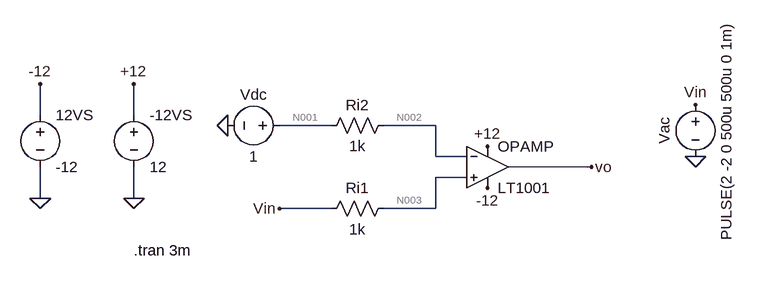
[diagram p0: schematic exp81.asc]
exp81.asc, the LTspice schematic file:
Version 4
SHEET 1 880 680
WIRE -464 64 -464 16
WIRE -320 64 -320 16
WIRE -16 80 -96 80
WIRE 144 80 64 80
WIRE 144 128 144 80
WIRE 192 128 144 128
WIRE 384 144 256 144
WIRE 192 160 144 160
WIRE -464 192 -464 144
WIRE -320 192 -320 144
WIRE -16 208 -96 208
WIRE 144 208 144 160
WIRE 144 208 64 208
FLAG -320 16 +12
FLAG -464 16 -12
FLAG -464 192 0
FLAG -320 192 0
FLAG 224 176 -12
FLAG 224 112 +12
FLAG 384 144 vo
FLAG -176 80 0
FLAG 544 128 0
FLAG 544 48 Vin
FLAG -96 208 Vin
SYMBOL voltage -320 48 R0
WINDOW 123 0 0 Left 0
WINDOW 39 0 0 Left 0
SYMATTR InstName -12VS
SYMATTR Value 12
SYMBOL voltage -464 48 R0
WINDOW 123 0 0 Left 0
WINDOW 39 0 0 Left 0
SYMATTR InstName 12VS
SYMATTR Value -12
SYMBOL OpAmps\\LT1001 224 80 R0
SYMATTR InstName OPAMP
SYMBOL res 80 64 R90
WINDOW 0 0 56 VBottom 2
WINDOW 3 32 56 VTop 2
SYMATTR InstName Ri2
SYMATTR Value 1k
SYMBOL res 80 192 R90
WINDOW 0 0 56 VBottom 2
WINDOW 3 32 56 VTop 2
SYMATTR InstName Ri1
SYMATTR Value 1k
SYMBOL voltage -80 80 R90
WINDOW 0 -32 56 VBottom 2
WINDOW 3 32 56 VTop 2
SYMATTR InstName Vdc
SYMATTR Value 1
SYMBOL voltage 544 32 R0
WINDOW 0 -32 56 VBottom 2
WINDOW 3 32 56 VTop 2
WINDOW 123 0 0 Left 0
WINDOW 39 0 0 Left 0
SYMATTR InstName Vac
SYMATTR Value PULSE(2 -2 0 500u 500u 0 1m)
TEXT -320 272 Left 2 !.tran 3m

The netlist it stands for:
* exp81.asc
V§-12VS +12 0 12
V§12VS -12 0 -12
XOPAMP N003 N002 +12 -12 vo LT1001  ; pins In+ In- V+ V- OUT
Ri2 N002 N001 1k
Ri1 N003 Vin 1k
Vdc N001 0 1
Vac Vin 0 PULSE(2 -2 0 500u 500u 0 1m)
.tran 3m
.lib LTC.lib
.backanno
.end

* Results of the author's LTspice run, read from the files saved beside the schematic
* Operating Point, zero values left out:
*   V(+12) = 12 V
*   V(-12) = -12 V
*   V(n002) = 1 V
*   V(n003) = 2 V
*   V(vo) = 11.07 V
*   V(n001) = 1 V
*   V(vin) = 2 V
*   I(Ri1) = -13.5 nA
*   I(Ri2) = 13.5 nA
*   I(Vac) = -13.5 nA
*   I(Vdc) = 13.5 nA
*   I(12vs) = 2.254 mA
*   I(-12vs) = -2.247 mA
*   Ix(opamp:1) = 13.5 nA
*   Ix(opamp:2) = -13.5 nA
*   Ix(opamp:3) = 2.247 mA
*   Ix(opamp:4) = -2.254 mA
*   Ix(opamp:5) = -22.14 pA
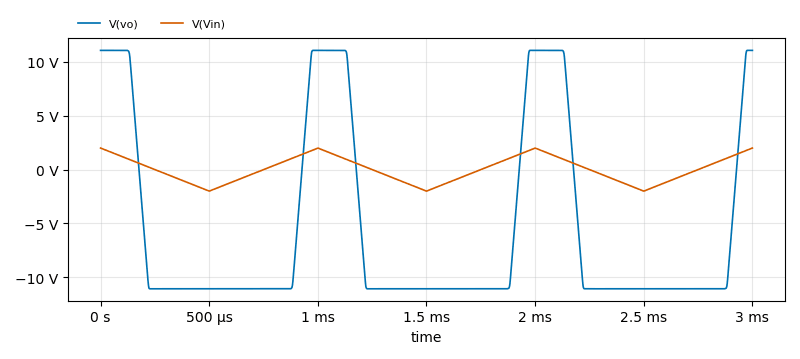
[diagram p1: Transient Analysis of exp81.asc, plotted from the saved traces]
* Transient Analysis, 1 run:
*   V(vo): min -11.07 V, max 11.07 V, average -5.536 V, rms 10.49 V, last 11.07 V
*   V(Vin): min -2 V, max 2 V, average 19.49 µV, rms 1.173 V, last 2 V